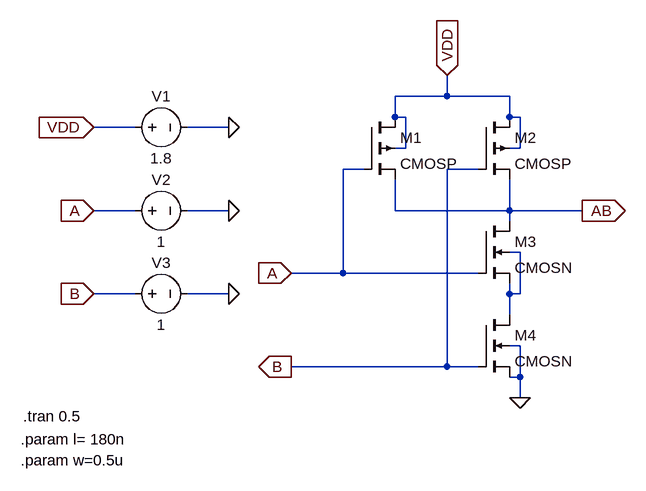
[diagram p0: schematic Draft2.asc]
Draft2.asc, the LTspice schematic file:
Version 4
SHEET 1 880 680
WIRE 224 16 224 -16
WIRE 224 16 144 16
WIRE 320 16 224 16
WIRE 144 48 144 16
WIRE 160 48 144 48
WIRE 320 48 320 16
WIRE 336 48 320 48
WIRE -256 64 -320 64
WIRE -112 64 -176 64
WIRE 160 96 160 48
WIRE 160 96 144 96
WIRE 336 96 336 48
WIRE 336 96 320 96
WIRE 96 128 64 128
WIRE 272 128 224 128
WIRE -256 192 -320 192
WIRE -112 192 -176 192
WIRE 144 192 144 144
WIRE 320 192 320 144
WIRE 320 192 144 192
WIRE 432 192 320 192
WIRE 320 208 320 192
WIRE 336 256 320 256
WIRE 64 288 64 128
WIRE 64 288 -16 288
WIRE 272 288 64 288
WIRE -256 320 -320 320
WIRE -112 320 -176 320
WIRE 320 320 320 304
WIRE 336 320 336 256
WIRE 336 320 320 320
WIRE 320 352 320 320
WIRE 336 400 320 400
WIRE 224 432 224 128
WIRE 224 432 -16 432
WIRE 272 432 224 432
WIRE 336 448 336 400
WIRE 336 448 320 448
WIRE 336 480 336 448
FLAG 224 -16 VDD
IOPIN 224 -16 In
FLAG 336 480 0
FLAG 432 192 AB
IOPIN 432 192 Out
FLAG -16 288 A
IOPIN -16 288 In
FLAG -16 432 B
IOPIN -16 432 Out
FLAG -112 64 0
FLAG -320 64 VDD
IOPIN -320 64 In
FLAG -320 192 A
IOPIN -320 192 In
FLAG -112 192 0
FLAG -320 320 B
IOPIN -320 320 In
FLAG -112 320 0
SYMBOL pmos4 96 48 R0
SYMATTR InstName M1
SYMATTR Value CMOSP
SYMATTR Value2 l=l w=w
SYMBOL pmos4 272 48 R0
SYMATTR InstName M2
SYMATTR Value CMOSP
SYMATTR Value2 l=l w=w
SYMBOL nmos4 272 208 R0
SYMATTR InstName M3
SYMATTR Value CMOSN
SYMATTR Value2 l=l w=w
SYMBOL nmos4 272 352 R0
SYMATTR InstName M4
SYMATTR Value CMOSN
SYMATTR Value2 l=l w=w
SYMBOL voltage -272 64 R270
WINDOW 0 32 56 VTop 2
WINDOW 3 -32 56 VBottom 2
WINDOW 123 0 0 Left 0
WINDOW 39 0 0 Left 0
SYMATTR InstName V1
SYMATTR Value 1.8
SYMBOL voltage -272 192 R270
WINDOW 0 32 56 VTop 2
WINDOW 3 -32 56 VBottom 2
WINDOW 123 0 0 Left 0
WINDOW 39 0 0 Left 0
SYMATTR InstName V2
SYMATTR Value 1
SYMBOL voltage -272 320 R270
WINDOW 0 32 56 VTop 2
WINDOW 3 -32 56 VBottom 2
WINDOW 123 0 0 Left 0
WINDOW 39 0 0 Left 0
SYMATTR InstName V3
SYMATTR Value 1
TEXT -428 508 Left 2 !.tran 0.5
TEXT -432 544 Left 2 !.param l= 180n
TEXT -432 576 Left 2 !.param w=0.5u

The netlist it stands for:
* Draft2.asc
M1 VDD A AB VDD CMOSP l=l w=w
M2 VDD B AB VDD CMOSP l=l w=w
M3 AB A N001 N001 CMOSN l=l w=w
M4 N001 B 0 0 CMOSN l=l w=w
V1 VDD 0 1.8
V2 A 0 1
V3 B 0 1
.model NMOS NMOS
.model PMOS PMOS
.lib standard.mos
.tran 0.5
.param l= 180n
.param w=0.5u
.backanno
.end